# Altium schematic sheet microcontroller module.SchDoc: Microcontroller Module (MCM)
size A4; Date: 2012-11-01; Author: Artur Scholz; DocumentNumber: LibreCube LC41-02a
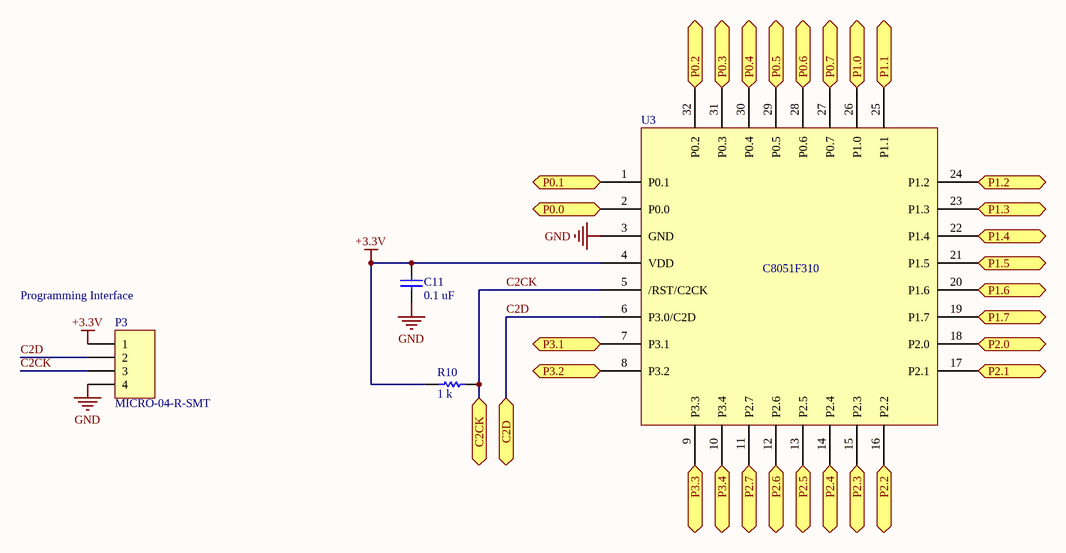
[diagram p0: microcontroller module.SchDoc]

## Parts
C11  0.1 uF  [0603]
P3  MICRO-04-R-SMT  [MICRO-04-R-SMT]
R10  1 k  [0603]
U3  C8051F310  [TQFP-32]

## Ports
C2CK, C2D, P0.0, P0.1, P0.2, P0.3, P0.4, P0.5, P0.6, P0.7, P1.0, P1.1, P1.2, P1.3, P1.4, P1.5, P1.6, P1.7, P2.0, P2.1, P2.2, P2.3, P2.4, P2.5, P2.6, P2.7, P3.1, P3.2, P3.3, P3.4

## Nets
+3.3V: C11.1 P3.1 R10.1 U3.4(VDD)
GND: C11.2 P3.4 U3.3(GND)
C2CK: P3.3 R10.2 U3.5(/RST/C2CK) ; port C2CK
C2D: P3.2 U3.6(P3.0/C2D) ; port C2D
P0.0: U3.2(P0.0) ; port P0.0
P0.1: U3.1(P0.1) ; port P0.1
P0.2: U3.32(P0.2) ; port P0.2
P0.3: U3.31(P0.3) ; port P0.3
P0.4: U3.30(P0.4) ; port P0.4
P0.5: U3.29(P0.5) ; port P0.5
P0.6: U3.28(P0.6) ; port P0.6
P0.7: U3.27(P0.7) ; port P0.7
P1.0: U3.26(P1.0) ; port P1.0
P1.1: U3.25(P1.1) ; port P1.1
P1.2: U3.24(P1.2) ; port P1.2
P1.3: U3.23(P1.3) ; port P1.3
P1.4: U3.22(P1.4) ; port P1.4
P1.5: U3.21(P1.5) ; port P1.5
P1.6: U3.20(P1.6) ; port P1.6
P1.7: U3.19(P1.7) ; port P1.7
P2.0: U3.18(P2.0) ; port P2.0
P2.1: U3.17(P2.1) ; port P2.1
P2.2: U3.16(P2.2) ; port P2.2
P2.3: U3.15(P2.3) ; port P2.3
P2.4: U3.14(P2.4) ; port P2.4
P2.5: U3.13(P2.5) ; port P2.5
P2.6: U3.12(P2.6) ; port P2.6
P2.7: U3.11(P2.7) ; port P2.7
P3.1: U3.7(P3.1) ; port P3.1
P3.2: U3.8(P3.2) ; port P3.2
P3.3: U3.9(P3.3) ; port P3.3
P3.4: U3.10(P3.4) ; port P3.4

## Notes on the sheet
- (near P3) Programming Interface

## Library data of the parts
C11 = Cap: Published: 8-Jun-2000; Revision: July-2002: Re-released for DXP Platform.; Publisher: Altium Limited
P3 = MICRO-04: Micro Connector; LatestRevisionDate: 17-Jul-2002; LatestRevisionNote: Re-released for DXP Platform.; Publisher: Altium Limited
R10 = Res1: Published: 8-Jun-2000; LatestRevisionDate: 17-Jul-2002; LatestRevisionNote: Re-released for DXP Platform.; PackageReference: AXIAL-0.3; Publisher: Altium Limited
U3 = C8051F310: 336-1252-ND